# Altium schematic sheet Engine Sensors Breakaway.SchDoc: ENGINE SENSORS LOOM
size A4; CheckedBy: TIMOTHY WARNOCK; Author: TIMOTHY WARNOCK; CompanyName: CURTIN MOTORSPORT TEAM; DrawnBy: TIMOTHY WARNOCK; Engineer: TIMOTHY WARNOCK; Revision: 2; SheetNumber: 3; SheetTotal: 5; ProjectName: 2017 PERMANET LOOM
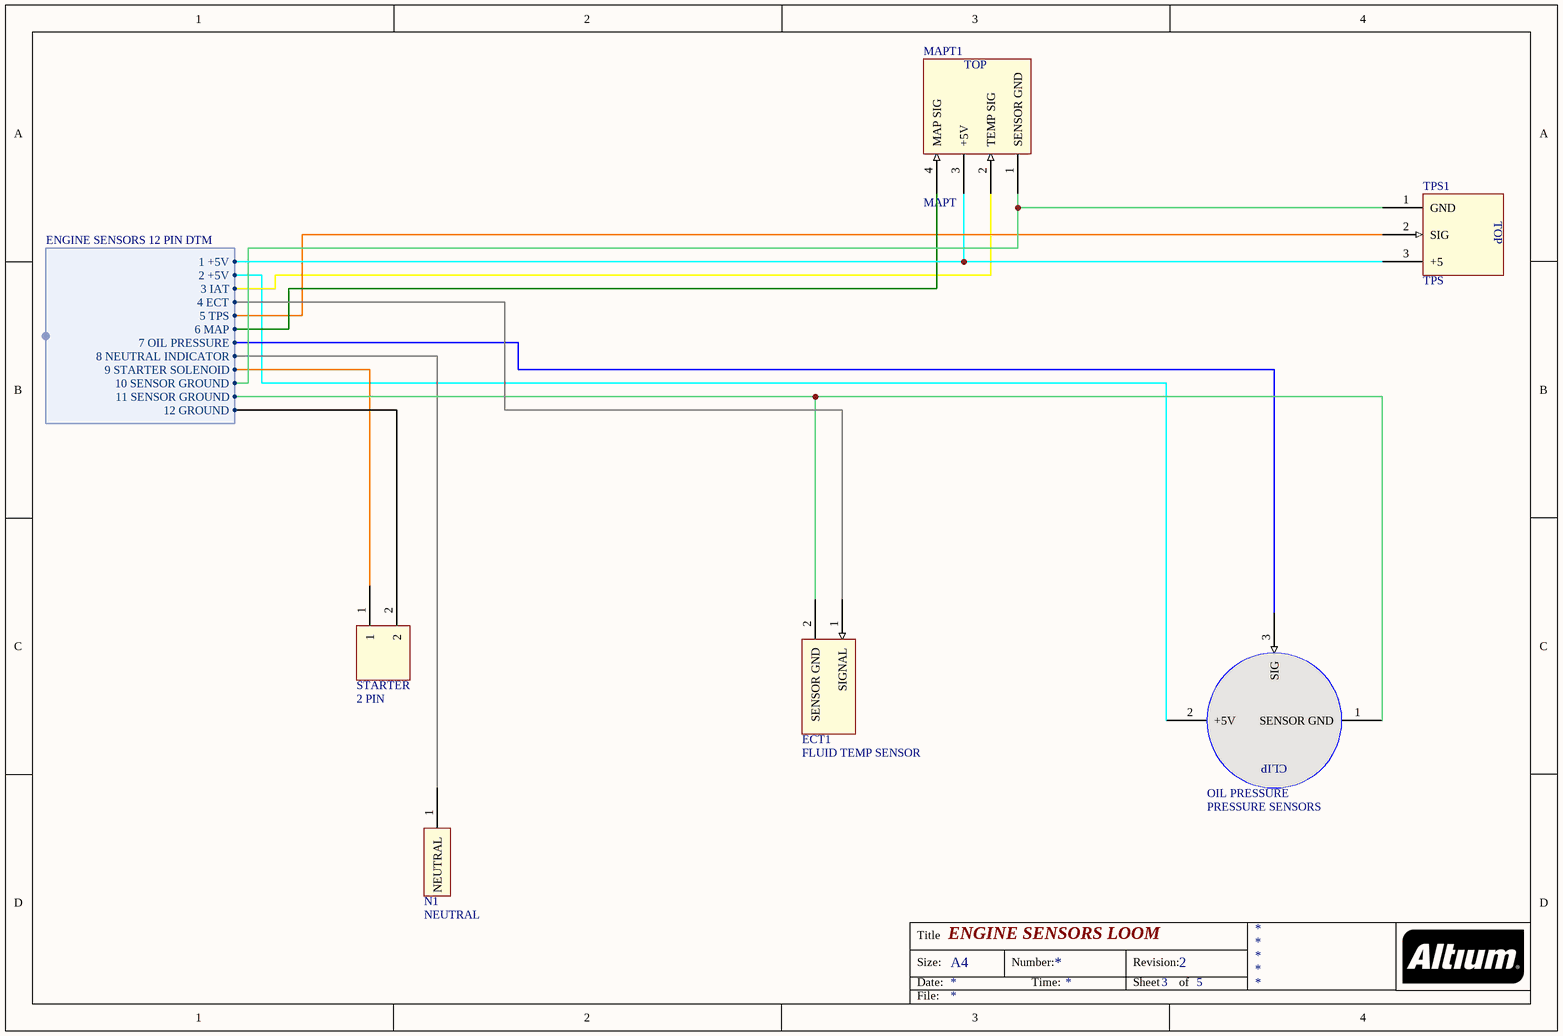
[diagram p0: Engine Sensors Breakaway.SchDoc]

## Parts
ECT1  FLUID TEMP SENSOR
MAPT1  MAPT
N1  NEUTRAL
OIL_PRESSURE  PRESSURE SENSORS
STARTER  2 PIN
TPS1  TPS

## Harnesses
ENGINE SENSORS 12 PIN DTM: 1 +5V, 2 +5V, 3 IAT, 4 ECT, 5 TPS, 6 MAP, 7 OIL PRESSURE, 8 NEUTRAL INDICATOR, 9 STARTER SOLENOID, 10 SENSOR GROUND, 11 SENSOR GROUND, 12 GROUND

## Nets
NetECT1_1: ECT1.1(SIGNAL) ; harness ENGINE SENSORS 12 PIN DTM.4 ECT
NetECT1_2: ECT1.2(SENSOR_GND) OIL_PRESSURE.1(SENSOR_GND) ; harness ENGINE SENSORS 12 PIN DTM.11 SENSOR GROUND
NetMAPT1_1: MAPT1.1(SENSOR_GND) TPS1.1(GND) ; harness ENGINE SENSORS 12 PIN DTM.10 SENSOR GROUND
NetMAPT1_2: MAPT1.2(TEMP_SIG) ; harness ENGINE SENSORS 12 PIN DTM.3 IAT
NetMAPT1_3: MAPT1.3(+5V) TPS1.3(+5) ; harness ENGINE SENSORS 12 PIN DTM.1 +5V
NetMAPT1_4: MAPT1.4(MAP_SIG) ; harness ENGINE SENSORS 12 PIN DTM.6 MAP
NetN1_1: N1.1(NEUTRAL) ; harness ENGINE SENSORS 12 PIN DTM.8 NEUTRAL INDICATOR
NetOIL_PRESSURE_2: OIL_PRESSURE.2(+5V) ; harness ENGINE SENSORS 12 PIN DTM.2 +5V
NetOIL_PRESSURE_3: OIL_PRESSURE.3(SIG) ; harness ENGINE SENSORS 12 PIN DTM.7 OIL PRESSURE
NetSTARTER_1: STARTER.1 ; harness ENGINE SENSORS 12 PIN DTM.9 STARTER SOLENOID
NetSTARTER_2: STARTER.2 ; harness ENGINE SENSORS 12 PIN DTM.12 GROUND
NetTPS1_2: TPS1.2(SIG) ; harness ENGINE SENSORS 12 PIN DTM.5 TPS

## Notes on the sheet
- Title
- Size:
- Date:
- A4
- Number:
- Time:
- Revision:
- Sheet
- of
- File:
- (in symbol MAPT) TOP
- (in symbol PRESSURE SENSORS) CLIP
- (in symbol TPS) TOP

## Library data of the parts
ECT1 = FLUID TEMP SENSOR: FOR OIL, FUEL, WATER
MAPT1 = MAPT: BOSCH 4 BAR MAP AND TEMP
OIL_PRESSURE = PRESSURE SENSORS: TEXAS INSTRUMENTS 150 PSI
TPS1 = TPS: ACUITY HALL EFFECT TPS